# Altium schematic sheet PMU.SchDoc
size C
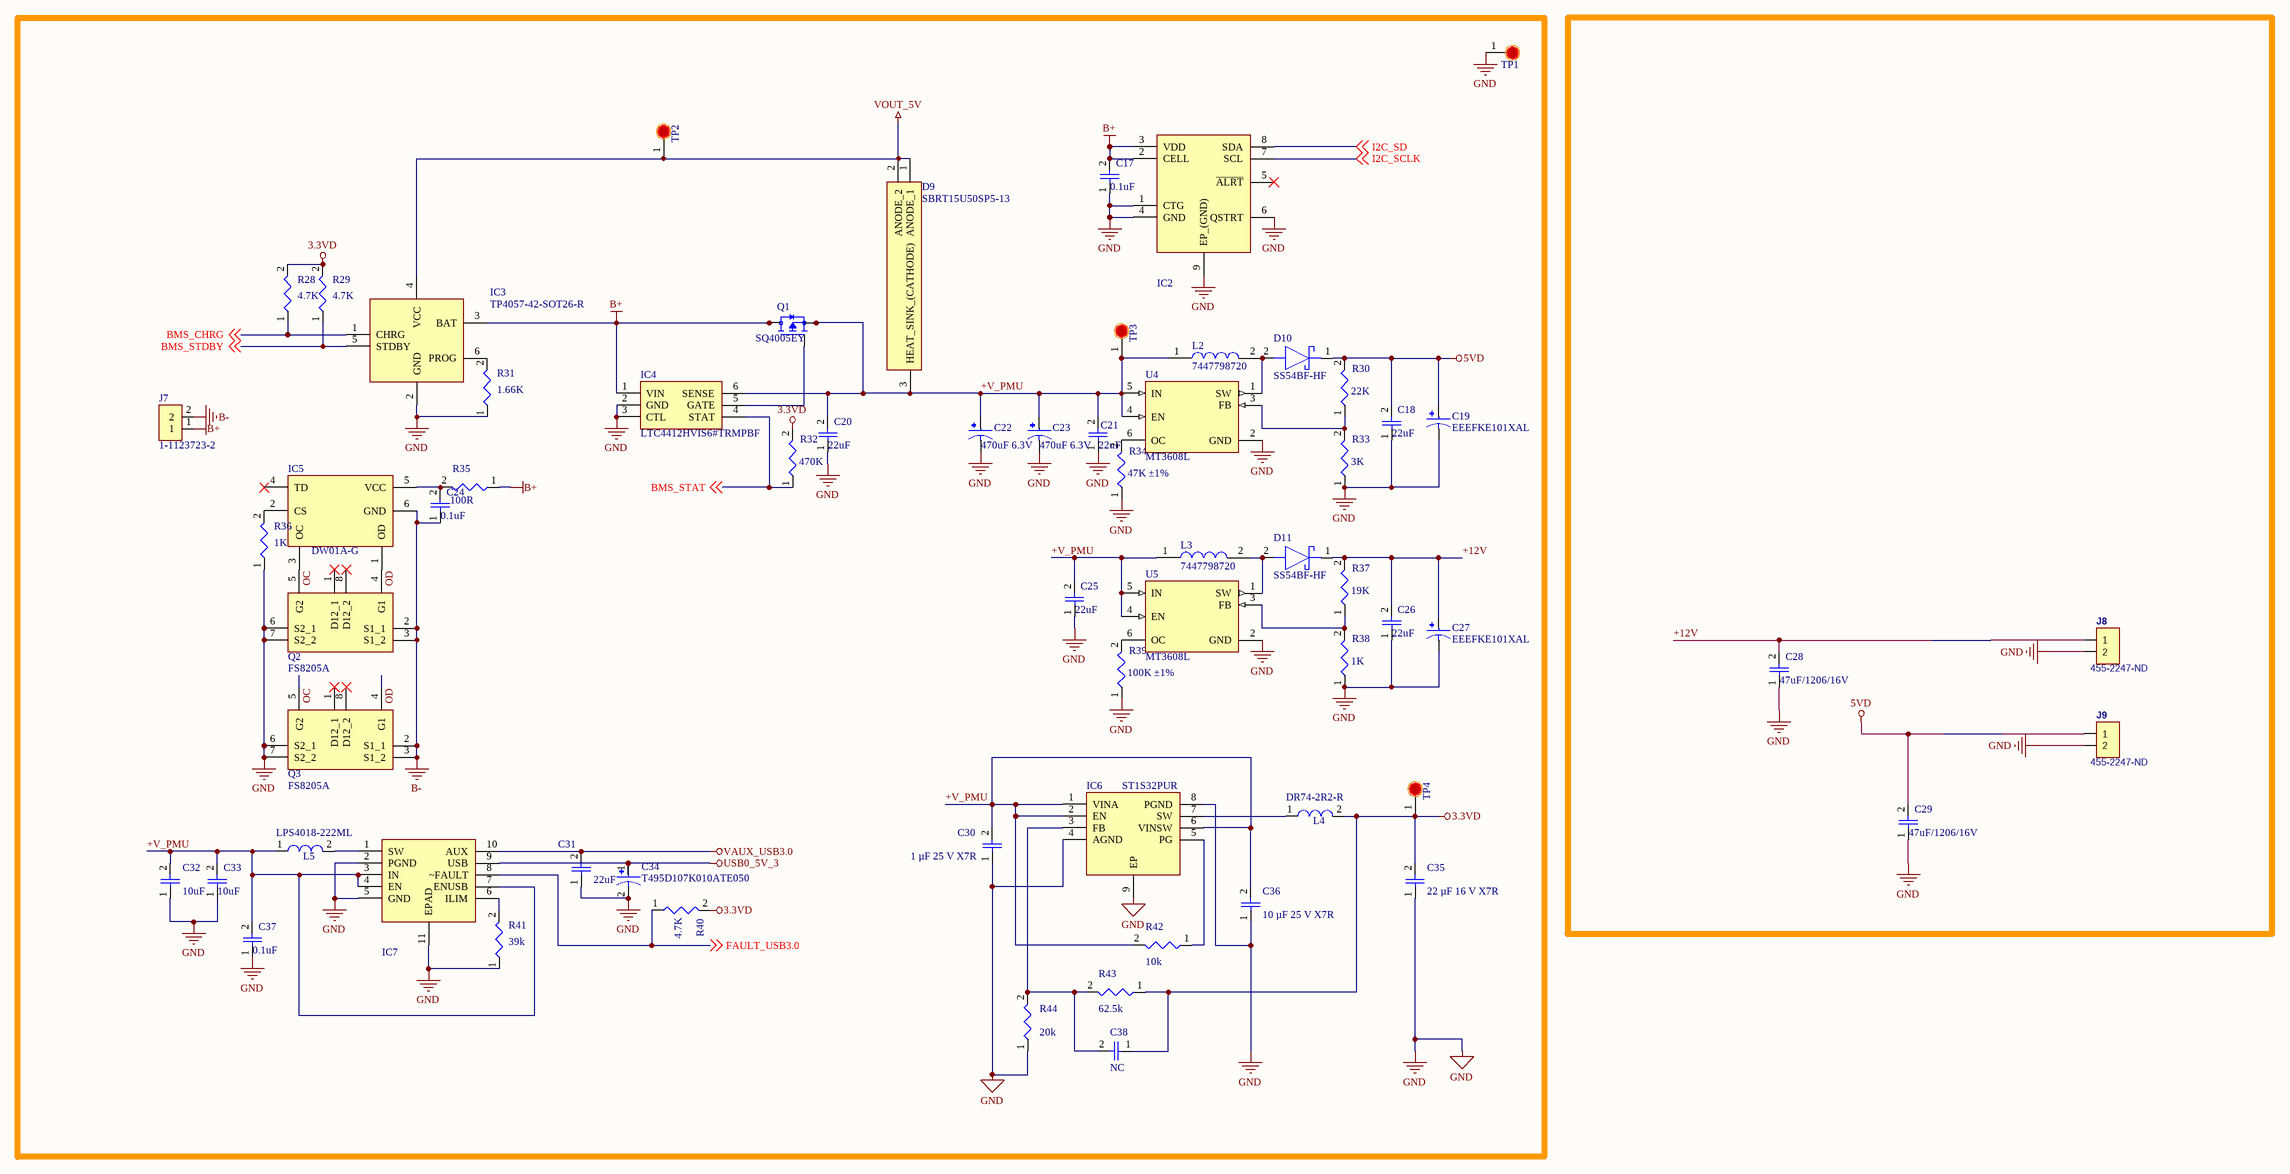
[diagram p0: PMU.SchDoc]

## Parts
C17  0.1uF  [0603-C]
C18  22uF  [1206-C]
C19  EEEFKE101XAL  [CAP_EEEFKE101XAL]
C20  22uF  [0603-C]
C21  22uF  [0603-C]
C22  470uF 6.3V  [CAP_EEEFK0J471P]
C23  470uF 6.3V  [CAP_EEEFK0J471P]
C24  0.1uF  [0603-C]
C25  22uF  [0603-C]
C26  22uF  [1206-C]
C27  EEEFKE101XAL  [CAP_EEEFKE101XAL]
C28  47uF/1206/16V  [1206-C]
C29  47uF/1206/16V  [1206-C]
C30  1 µF 25 V X7R  [0603-C]
C31  22uF  [1210-C]
C32  10uF  [1210-C]
C33  10uF  [0805-C]
C34  T495D107K010ATE050  [CAP_4TAE470ML]
C35  22 µF 16 V X7R  [1210-C]
C36  10 µF 25 V X7R  [1210-C]
C37  0.1uF  [0603-C]
C38  NC  [0603-C]
D9  SBRT15U50SP5-13  [POWERDI5]
D10  SS54BF-HF  [SODFL5336X130N]
D11  SS54BF-HF  [SODFL5336X130N]
IC2  MAX17048G+T10  [SON50P200X200X80-9N-D]  (value not drawn)
IC3  TP4057-42-SOT26-R  [SOT95P280X125-6N]
IC4  LTC4412HVIS6#TRMPBF  [SOT95P280X100-6N]
IC5  DW01A-G  [SOT95P280X135-6N]
IC6  ST1S32PUR  [SON80P400X400X100-9N-D]
IC7  TPS2500DRCT  [SON50P300X300X100-11N]  (value not drawn)
J7  1-1123723-2  [TE_1-1123723-2]
J8  455-2247-ND  [CON_HDR1x2]
J9  455-2247-ND  [CON_HDR1x2]
L2  7447798720  [CDRH103RNP6R8NCB]
L3  7447798720  [CDRH103RNP6R8NCB]
L4  DR74-2R2-R  [INDM7676X435N]
L5  LPS4018-222ML  [VLC5045]
Q1  SQ4005EY  [SOIC127P600X175-8N]
Q2  FS8205A  [SOP65P640X120-8N]
Q3  FS8205A  [SOP65P640X120-8N]
R28  4.7K  [0402-R]
R29  4.7K  [0402-R]
R30  22K  [0603-R]
R31  1.66K  [0603-R]
R32  470K  [0402-R]
R33  3K  [0603-R]
R34  47K ±1%  [0603-R]
R35  100R  [0603-R]
R36  1K  [0603-R]
R37  19K  [0603-R]
R38  1K  [0603-R]
R39  100K ±1%  [0603-R]
R40  4.7K  [0402-R]
R41  39k  [0603-R]
R42  10k  [0603-R]
R43  62.5k  [0603-R]
R44  20k  [0603-R]
TP1  TP  [TP_SMD]  (value not drawn)
TP2  TP  [TP_SMD]  (value not drawn)
TP3  TP  [TP_SMD]  (value not drawn)
TP4  TP  [TP_SMD]  (value not drawn)
U4  MT3608L  [SOT95P280X145-6N]
U5  MT3608L  [SOT95P280X145-6N]

## Nets
3.3VD: C35.2 C38.1 L4.2 R28.2 R29.2 R32.2 R40.2 R43.1 TP4.1
5VD: C18.2 C19.1 C29.2 D10.1(K) J9.1 R30.2
B+: C17.2 IC2.2(CELL) IC2.3(VDD) IC3.3(BAT) IC4.1(VIN) J7.1 Q1.5(D) Q1.6(D) Q1.7(D) Q1.8(D) R35.1
B-: C24.1 IC5.6(GND) J7.2 Q2.2(S1_1) Q2.3(S1_2) Q3.2(S1_1) Q3.3(S1_2)
GND: C17.1 C18.1 C19.2 C20.1 C21.1 C22.2 C23.2 C25.1 C26.1 C27.2 C28.1 C29.1 C30.1 C31.1 C32.1 C33.1 C34.2 C35.1 C36.1 C37.1 IC2.1(CTG) IC2.4(GND) IC2.6(QSTRT) IC2.9(EP_(GND)) IC3.2(GND) IC4.2(GND) IC4.3(CTL) IC6.4(AGND) IC6.8(PGND) IC6.9(EP) IC7.2(PGND) IC7.5(GND) IC7.11(EPAD) J8.2 J9.2 Q2.6(S2_1) Q2.7(S2_2) Q3.6(S2_1) Q3.7(S2_2) R31.1 R33.1 R34.1 R36.1 R38.1 R39.1 R41.1 R44.1 TP1.1 U4.2(GND) U5.2(GND)
USB0_5V_3: C34.1 IC7.9(USB)
VAUX_USB3.0: C31.2 IC7.10(AUX)
VOUT_5V: D9.1(ANODE_1) D9.2(ANODE_2) IC3.4(VCC) TP2.1
+12V: C26.2 C27.1 C28.2 D11.1(K) J8.1 R37.2
+V_PMU: C20.2 C21.2 C22.1 C23.1 C25.2 C30.2 C32.2 C33.2 C36.2 C37.2 D9.3(HEAT_SINK_(CATHODE)) IC4.6(SENSE) IC6.1(VINA) IC6.2(EN) IC6.6(VINSW) IC7.3(IN) IC7.4(EN) IC7.7(ENUSB) L2.1 L3.1 L5.1 Q1.1(S) Q1.2(S) Q1.3(S) R42.2 TP3.1 U4.4(EN) U4.5(IN) U5.4(EN) U5.5(IN)
BMS_CHRG: IC3.1(CHRG) R28.1 ; off-sheet BMS_CHRG
BMS_STAT: IC4.4(STAT) R32.1 ; off-sheet BMS_STAT
BMS_STDBY: IC3.5(STDBY) R29.1 ; off-sheet BMS_STDBY
FAULT_USB3.0: IC7.8(~FAULT) R40.1 ; off-sheet FAULT_USB3.0
I2C_SCLK: IC2.7(SCL) ; off-sheet I2C_SCLK
I2C_SD: IC2.8(SDA) ; off-sheet I2C_SD
OC: IC5.3(OC) Q2.5(G2) Q3.5(G2)
OD: IC5.1(OD) Q2.4(G1) Q3.4(G1)
NetC24_2: C24.2 IC5.5(VCC) R35.2
NetC38_2: C38.2 IC6.3(FB) R43.2 R44.2
NetD10_2: D10.2(A) L2.2 U4.1(SW)
NetD11_2: D11.2(A) L3.2 U5.1(SW)
NetIC3_6: IC3.6(PROG) R31.2
NetIC4_5: IC4.5(GATE) Q1.4(G)
NetIC5_2: IC5.2(CS) R36.2
NetIC6_5: IC6.5(PG) R42.1
NetIC6_7: IC6.7(SW) L4.1
NetIC7_1: IC7.1(SW) L5.2
NetIC7_6: IC7.6(ILIM) R41.2
NetR30_1: R30.1 R33.2 U4.3(FB)
NetR34_2: R34.2 U4.6(OC)
NetR37_1: R37.1 R38.2 U5.3(FB)
NetR39_2: R39.2 U5.6(OC)

Not connected (* = marked no-connect by the designer): IC2 5(~{ALRT})*; IC5 4(TD)*; Q2 1(D12_1)* 8(D12_2)*; Q3 1(D12_1)* 8(D12_2)*

## Library data of the parts
C17 C18 C20 C21 C24-C26 C28-C33 C35-C38 = CAP
C19 C27 = EEEFKE101XAL: CAP ALUM 100UF 20% 25V SMD; MF: Panasonic; Check_prices: https://www.snapeda.com/parts/EEEFKE101XAL/Panasonic/view-part/5785135/?ref=eda; Package: RADIAL-2 Panasonic; Value: *; Digi-Key_Part_Number: 10-EEE-FKE101XALCT-ND; MP: EEEFKE101XAL; SnapEDA_Link: https://www.snapeda.com/parts/EEEFKE101XAL/Panasonic/view-part/5785135/?ref=snap
C22 C23 = EEEFK0J471P
C34 = T495D107K010ATE050: Cap Tant Solid 100uF 10V D CASE 10% (7.3 X 4.3 X 2.8mm) SMD 7343-31 0.05 Ohm 125°C T/R; Manufacturer: KEMET; ESR (Equivalent Series Resistance): 50mR; Polarity: Polar; Life (Hours): 2000Hour; Dissipation Factor: 8%; Supplier 1: Newark; Manufacturer Part Number: T495D107K010ATE050; RoHS: Yes; Category: Tantalum Capacitors; Stock 1: 224; Pricing 1: 1=2.46000, 10=2.00000, 25=1.84000, 50=1.69000, 100=1.53000 (USD); Mount: Surface Mount; Case/Package: 2917; Number of Pins: 2; Case Code (Imperial): 2917; Case Code (Metric): 7343; Min Operating Temperature: -55°C; Max Operating Temperature: 125°C; Packaging: Tape and Reel; Capacitance: 100uF; Tolerance: 10%; Voltage Rating: 10V; Package Quantity: 500; Termination: SMD/SMT; Voltage Rating (DC): 10V; Features: General Purpose; Series: T495; Construction: Flat; Length: 7.3mm; Width: 4.3mm; Height: 3.1mm; Height - Seated (Max): 0.122inch; Depth: 4.3mm; Radiation Hardening: No; REACH SVHC: No SVHC; RoHS Compliant: Yes; ComponentLink1URL: http://www.farnell.com/datasheets/2319914.pdf?src-supplier=Farnell; ComponentLink1Description: http://www.farnell.com/datasheets/2319914.pdf?src-supplier=Farnell; ComponentLink2URL: http://www.mouser.com/ds/2/212/KEM_T2071_T495_COTS-1104607.pdf?src-supplier=Mouser; ComponentLink2Description: http://www.mouser.com/ds/2/212/KEM_T2071_T495_COTS-1104607.pdf?src-supplier=Mouser; ComponentLink3URL: http://www.farnell.com/datasheets/2015705.pdf?src-supplier=Farnell; ComponentLink3Description: http://www.farnell.com/datasheets/2015705.pdf?src-supplier=Farnell; ComponentLink4URL: http://www.farnell.com/datasheets/2015705.pdf?src-supplier=Element14; ComponentLink4Description: http://www.farnell.com/datasheets/2015705.pdf?src-supplier=Element14; ComponentLink5URL: https://api.kemet.com/component-edge/download/datasheet/T495D107K010ASE100.pdf?src-supplier=Digi-Key; ComponentLink5Description: https://api.kemet.com/component-edge/download/datasheet/T495D107K010ASE100.pdf?src-supplier=Digi-Key; ComponentLink6URL: http://www.kemet.com/Lists/ProductCatalog/Attachments/261/KEM_T2009_T495.pdf?src-supplier=Avnet; ComponentLink6Description: http://www.kemet.com/Lists/ProductCatalog/Attachments/261/KEM_T2009_T495.pdf?src-supplier=Avnet; ComponentLink7URL: http://www.kemet.com/kemet/web/homepage/kechome.nsf/weben/1AABD97F96BDDBDA8525795A0050FFCA/$file/KEM_T2009_T495.pdf?src-supplier=Avnet; ComponentLink7Description: http://www.kemet.com/kemet/web/homepage/kechome.nsf/weben/1AABD97F96BDDBDA8525795A0050FFCA/$file/KEM_T2009_T495.pdf?src-supplier=Avnet; ComponentLink8URL: http://www.farnell.com/datasheets/2319914.pdf?src-supplier=Newark; ComponentLink8Description: http://www.farnell.com/datasheets/2319914.pdf?src-supplier=Newark; ComponentLink9URL: http://components.arrow.com/part/dataview/44988739S8665845N7429?src-supplier=Arrow+Electronics; ComponentLink9Description: http://components.arrow.com/part/dataview/44988739S8665845N7429?src-supplier=Arrow+Electronics; Supplier Part Number 1: 77Y7860
D9 = SBRT15U50SP5-13: Diode; Manufacturer_Name: Diodes Inc.; Datasheet Link: http://media.digikey.com/pdf/Data%20Sheets/Diodes%20PDFs/SBRT15U50SP5.pdf; Manufacturer_Part_Number: SBRT15U50SP5-13; Mouser Part Number: 621-SBRT15U50SP5-13; Mouser Price/Stock: https://www.mouser.co.uk/ProductDetail/Diodes-Incorporated/SBRT15U50SP5-13?qs=dZoB6MK9LKNtZyLX7B5L8A%3D%3D; Arrow Part Number: SBRT15U50SP5-13; Arrow Price/Stock: https://www.arrow.com/en/products/sbrt15u50sp5-13/diodes-incorporated?region=nac
D10 D11 = SS54BF-HF: Schottky Diode; Manufacturer_Name: Comchip Technology; Datasheet Link: https://www.mouser.co.uk/datasheet/2/80/20190807092834-2504956.pdf; Height: 1.3mm; Manufacturer_Part_Number: SS54BF-HF; Mouser Part Number: 750-SS54BF-HF; Mouser Price/Stock: https://www.mouser.co.uk/ProductDetail/Comchip-Technology/SS54BF-HF?qs=GBLSl2AkirsPcLFwlU2Ctg%3D%3D; Arrow Part Number: SS54BF-HF; Arrow Price/Stock: https://www.arrow.com/en/products/ss54bf-hf/comchip-technology?region=nac
IC2 = MAX17048G+T10: Integrated Circuit; Manufacturer_Name: Maxim Integrated; Datasheet Link: https://datasheets.maximintegrated.com/en/ds/MAX17048-MAX17049.pdf; Height: 0.8mm; Manufacturer_Part_Number: MAX17048G+T10; Mouser Part Number: 700-MAX17048G+T10; Mouser Price/Stock: https://www.mouser.co.uk/ProductDetail/Maxim-Integrated/MAX17048G%2bT10?qs=D7PJwyCwLAoGnnn8jEPRBQ%3D%3D; Arrow Part Number: MAX17048G+T10; Arrow Price/Stock: https://www.arrow.com/en/products/max17048gt10/maxim-integrated?region=nac
IC3 = TP4057-42-SOT26-R: Integrated Circuit; Manufacturer_Name: Nanjing Extension Microelectronics; Datasheet Link: https://datasheet.lcsc.com/szlcsc/Nanjing-Extension-Microelectronics-TP4057_C12044.pdf; Height: 1.25mm; Manufacturer_Part_Number: TP4057-42-SOT26-R
IC4 = LTC4412HVIS6#TRMPBF: Integrated Circuit; Manufacturer_Name: Linear Technology; Datasheet Link: https://datasheet.datasheetarchive.com/originals/dk/DKDS-14/267243.pdf; Height: 1mm; Manufacturer_Part_Number: LTC4412HVIS6#TRMPBF; Mouser Part Number: 584-C4412HVIS6TRMPBF; Mouser Price/Stock: https://www.mouser.co.uk/ProductDetail/Analog-Devices-Linear-Technology/LTC4412HVIS6TRMPBF?qs=hVkxg5c3xu%2F0qD9zc%2Fd4vw%3D%3D; Arrow Part Number: LTC4412HVIS6#TRMPBF; Arrow Price/Stock: https://www.arrow.com/en/products/ltc4412hvis6trmpbf/linear-technology
IC5 = DW01A-G: Integrated Circuit; Manufacturer_Name: Fortune Semiconductor Corporation; Datasheet Link: http://acoptex.com/uploads/DW01A.pdf; Height: 1.35mm; Manufacturer_Part_Number: DW01A-G
IC6 = ST1S32PUR: Integrated Circuit; Manufacturer_Name: STMicroelectronics; Datasheet Link: http://www.st.com/web/en/resource/technical/document/datasheet/DM00056321.pdf; Height: 1mm; Manufacturer_Part_Number: ST1S32PUR; Mouser Part Number: 511-ST1S32PUR; Mouser Price/Stock: https://www.mouser.co.uk/ProductDetail/STMicroelectronics/ST1S32PUR?qs=gNDSiZmRJS9JfBN%2Fr%252BmKGQ%3D%3D; Arrow Part Number: ST1S32PUR; Arrow Price/Stock: https://www.arrow.com/en/products/st1s32pur/stmicroelectronics?region=europe
IC7 = TPS2500DRCT: Integrated Circuit; Manufacturer_Name: Texas Instruments; Datasheet Link: http://www.ti.com/lit/gpn/TPS2500; Manufacturer_Part_Number: TPS2500DRCT; Mouser Part Number: 595-TPS2500DRCT; Mouser Price/Stock: https://www.mouser.co.uk/ProductDetail/Texas-Instruments/TPS2500DRCT?qs=IK5e5L0zOXg4%252Be3iAH4kIA%3D%3D; Arrow Part Number: TPS2500DRCT; Arrow Price/Stock: https://www.arrow.com/en/products/tps2500drct/texas-instruments
J7 = 1-1123723-2: 3.96 EP HDR ASSY 2P_NATURAL_; Number_of_Positions: 2; MF: TE Connectivity; Product_Type: Header; Centerline_Pitch: 3.96 mm[.156 in]; EU_RoHS_Compliance: Compliant; Value: *; TE_purchase_URL: https://www.te.com/usa-en/product-1-1123723-2.html?te_bu=Cor&te_type=disp&te_campaign=seda_glo_cor-seda-global-disp-prtnr-fy19-seda-model-bom-cta_sma-317_1&elqCampaignId=32493; SnapEDA_Link: https://www.snapeda.com/parts/1-1123723-2/TE%20Connectivity%20AMP%20Connectors/view-part/231687/?ref=snap; Package: None; MP: 1-1123723-2; Digi-Key_Purchase_URL: https://www.digikey.com/product-detail/en/te-connectivity-amp-connectors/1-1123723-2/A111830-ND/686925?utm_source=snapeda&utm_medium=aggregator&utm_campaign=symbol; Digi-Key_Part_Number: A111830-ND
J8 J9 = CON_HDR1x2: ComponentLink1URL: https://www.jst-mfg.com/product/pdf/eng/eXH.pdf; ComponentLink1Description: Datasheet
L2 L3 = 7447798720: Fixed Ind 7.2UH 7.9A 12.8 Mohm; Manufacturer: Wurth Electronics; Core Material: Metal,Composite; Saturation Current: 6A; Tolerance: 30%; Shielding: Shielded; Self Resonant Frequency: 31MHz; DC Resistance (DCR): 12.8mR; Test Frequency: 100kHz; Max DC Current: 6.5A; Supplier 1: Newark; Manufacturer Part Number: 7447798720; RoHS: Yes; Category: Fixed Inductors; Stock 1: 203; Pricing 1: 1=3.34000, 10=3.09000, 25=3.05000, 50=3.02000, 100=2.98000, 250=2.65000 (USD); Mount: Surface Mount; Case/Package: Nonstandard; Min Operating Temperature: -40°C; Max Operating Temperature: 150°C; Package Quantity: 1; Current Rating: 7.9A; Packaging: Tape and Reel; Inductance Tolerance: 30%; Resistor Type: Wirewound; Inductance: 7.2uH; Termination: SMD/SMT; RMS Current (Irms): 7.9A; Series: WE-PDF; Length: 0.402inch; Width: 0.402inch; Height: 6.4mm; Height - Seated (Max): 0.252inch; REACH SVHC: Unknown; RoHS Compliant: Yes; ComponentLink1URL: https://datasheet.ciiva.com/7892/1736564-7892967.pdf?src-supplier=Element14; ComponentLink1Description: https://datasheet.ciiva.com/7892/1736564-7892967.pdf?src-supplier=Element14; ComponentLink2URL: https://datasheet.ciiva.com/6171/530544-6171082.pdf?src-supplier=Farnell; ComponentLink2Description: https://datasheet.ciiva.com/6171/530544-6171082.pdf?src-supplier=Farnell; ComponentLink3URL: https://datasheet.ciiva.com/4954/7447798720-38957-4954724.pdf?src-supplier=Mouser; ComponentLink3Description: https://datasheet.ciiva.com/4954/7447798720-38957-4954724.pdf?src-supplier=Mouser; ComponentLink4URL: https://datasheet.ciiva.com/1060/7447798720-1060960.pdf?src-supplier=Digi-Key; ComponentLink4Description: https://datasheet.ciiva.com/1060/7447798720-1060960.pdf?src-supplier=Digi-Key; ComponentLink5URL: https://datasheet.ciiva.com/1060/7447798720-1060961.pdf?src-supplier=Digi-Key; ComponentLink5Description: https://datasheet.ciiva.com/1060/7447798720-1060961.pdf?src-supplier=Digi-Key; ComponentLink6URL: https://datasheet.ciiva.com/1060/7447798720-1060962.pdf?src-supplier=Digi-Key; ComponentLink6Description: https://datasheet.ciiva.com/1060/7447798720-1060962.pdf?src-supplier=Digi-Key; Supplier Part Number 1: 78R5736
L5 = IND/VLC5045
Q1 = SQ4005EY: MOSFET P Ch -12Vds 8Vgs
Q2 Q3 = FS8205A: Transistor; Manufacturer_Name: SII Semiconductor; Datasheet Link: http://www.ic-fortune.com/upload/Download/FS8205A-DS-12_EN.pdf; Height: 1.2mm; Manufacturer_Part_Number: FS8205A
R28-R44 = Res
TP1-TP4 = Test Pad
U4 U5 = MT3608L: High Efficiency 1.2MHz2A Step Up Converter; MF: Aerosemi Technology Co., Ltd; MP: MT3608; Package: Package Analog Devices; Availability: Unavailable; Value: *; SnapEDA_Link: https://www.snapeda.com/parts/MT3608/Aerosemi%20Technology%20Co.%2C%20Ltd/view-part/3218014/?ref=snap; Price: None